# EAGLE board STXY (EAGLE 9.6.2)
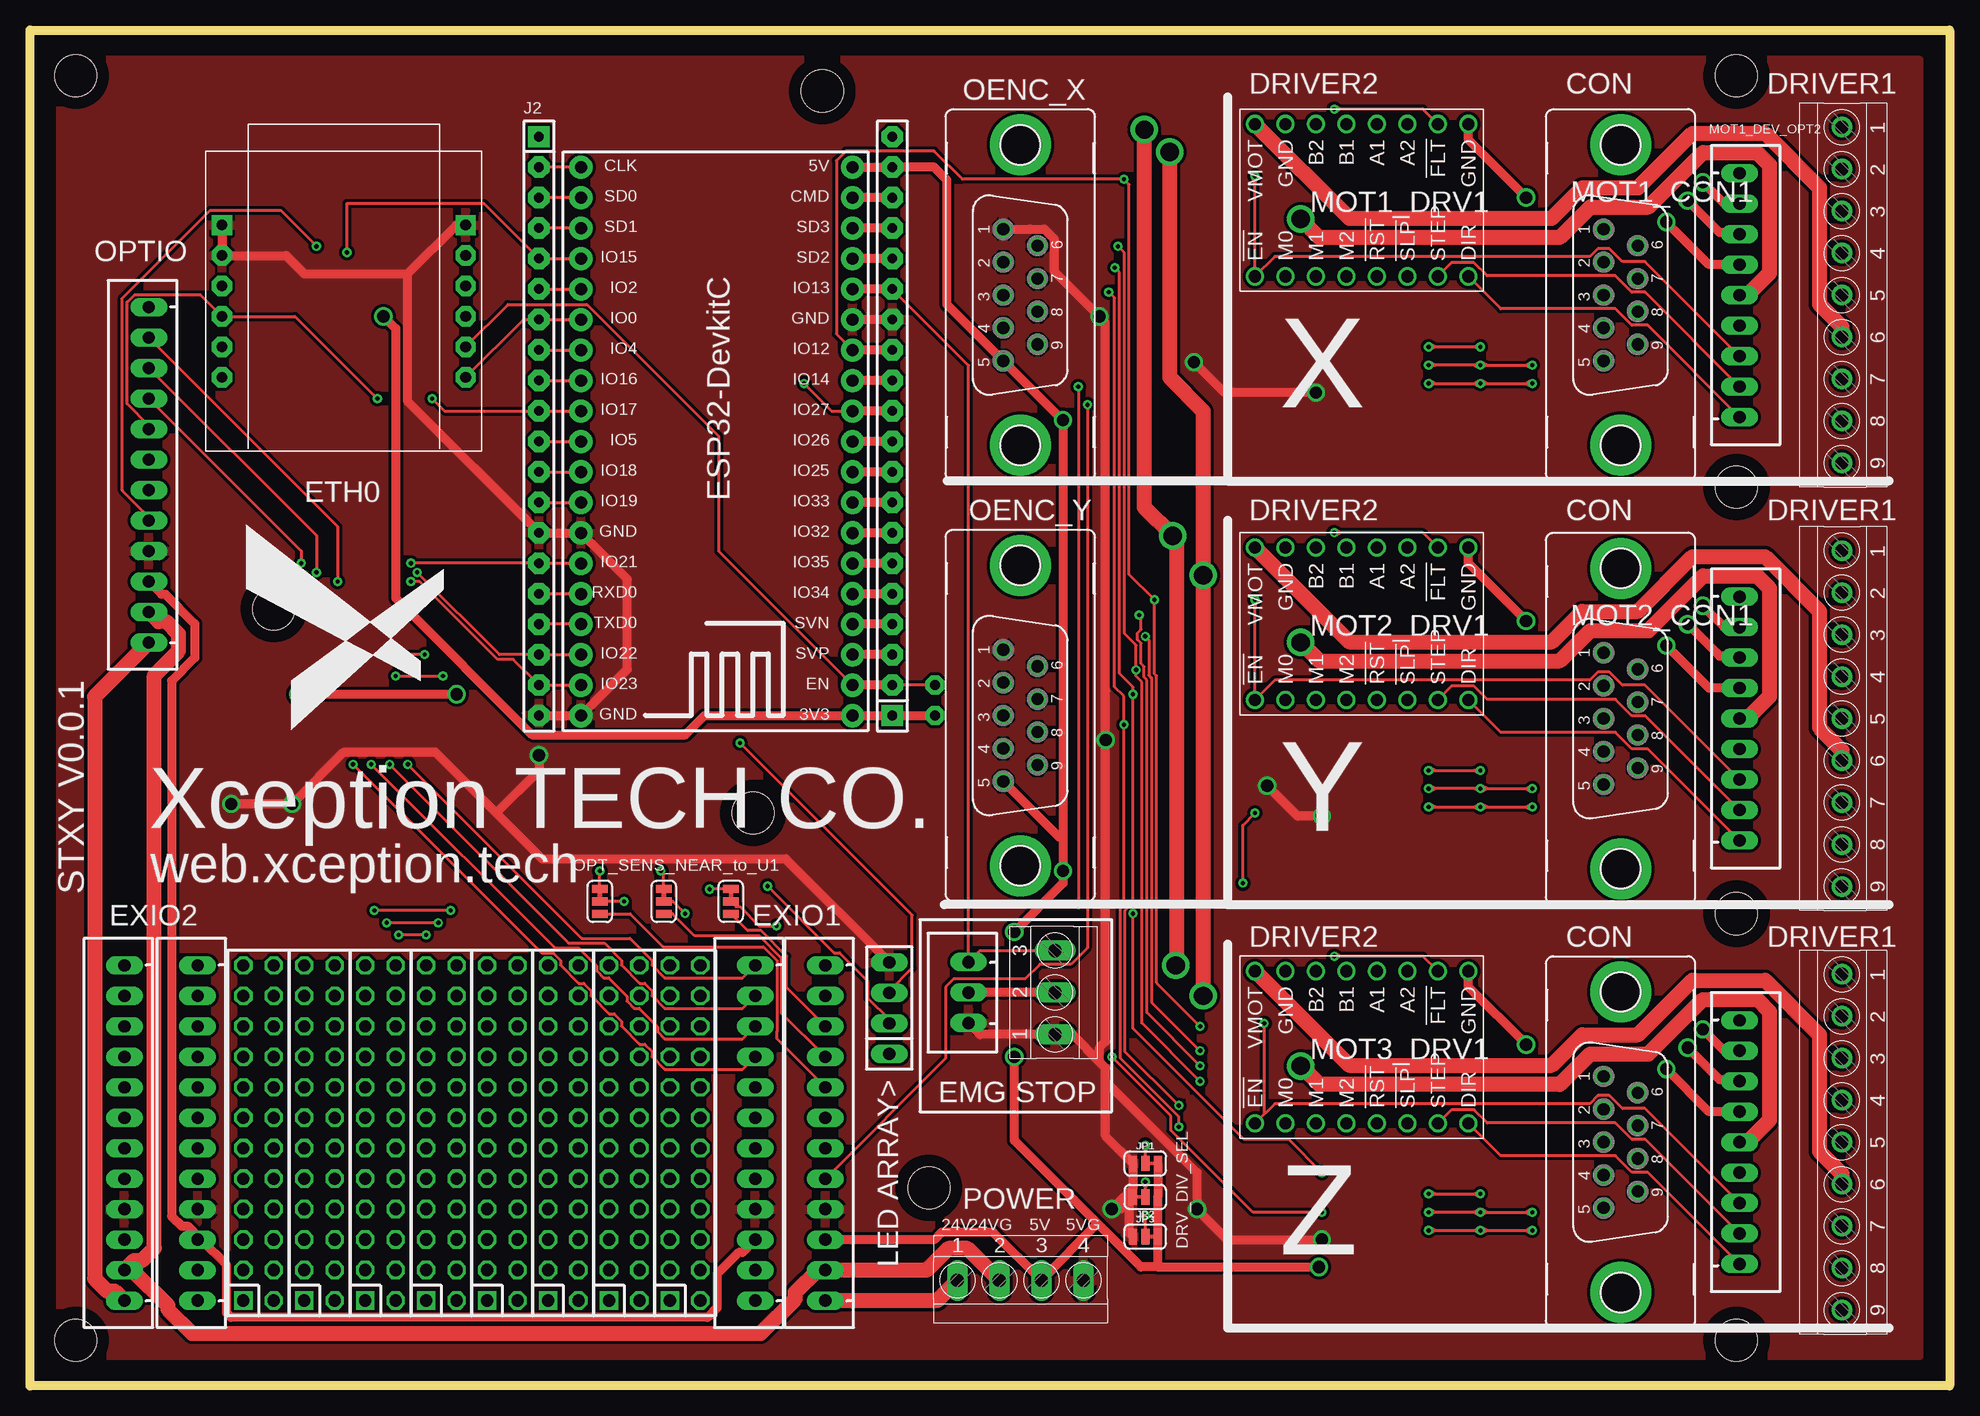
[diagram p4: board, top side]
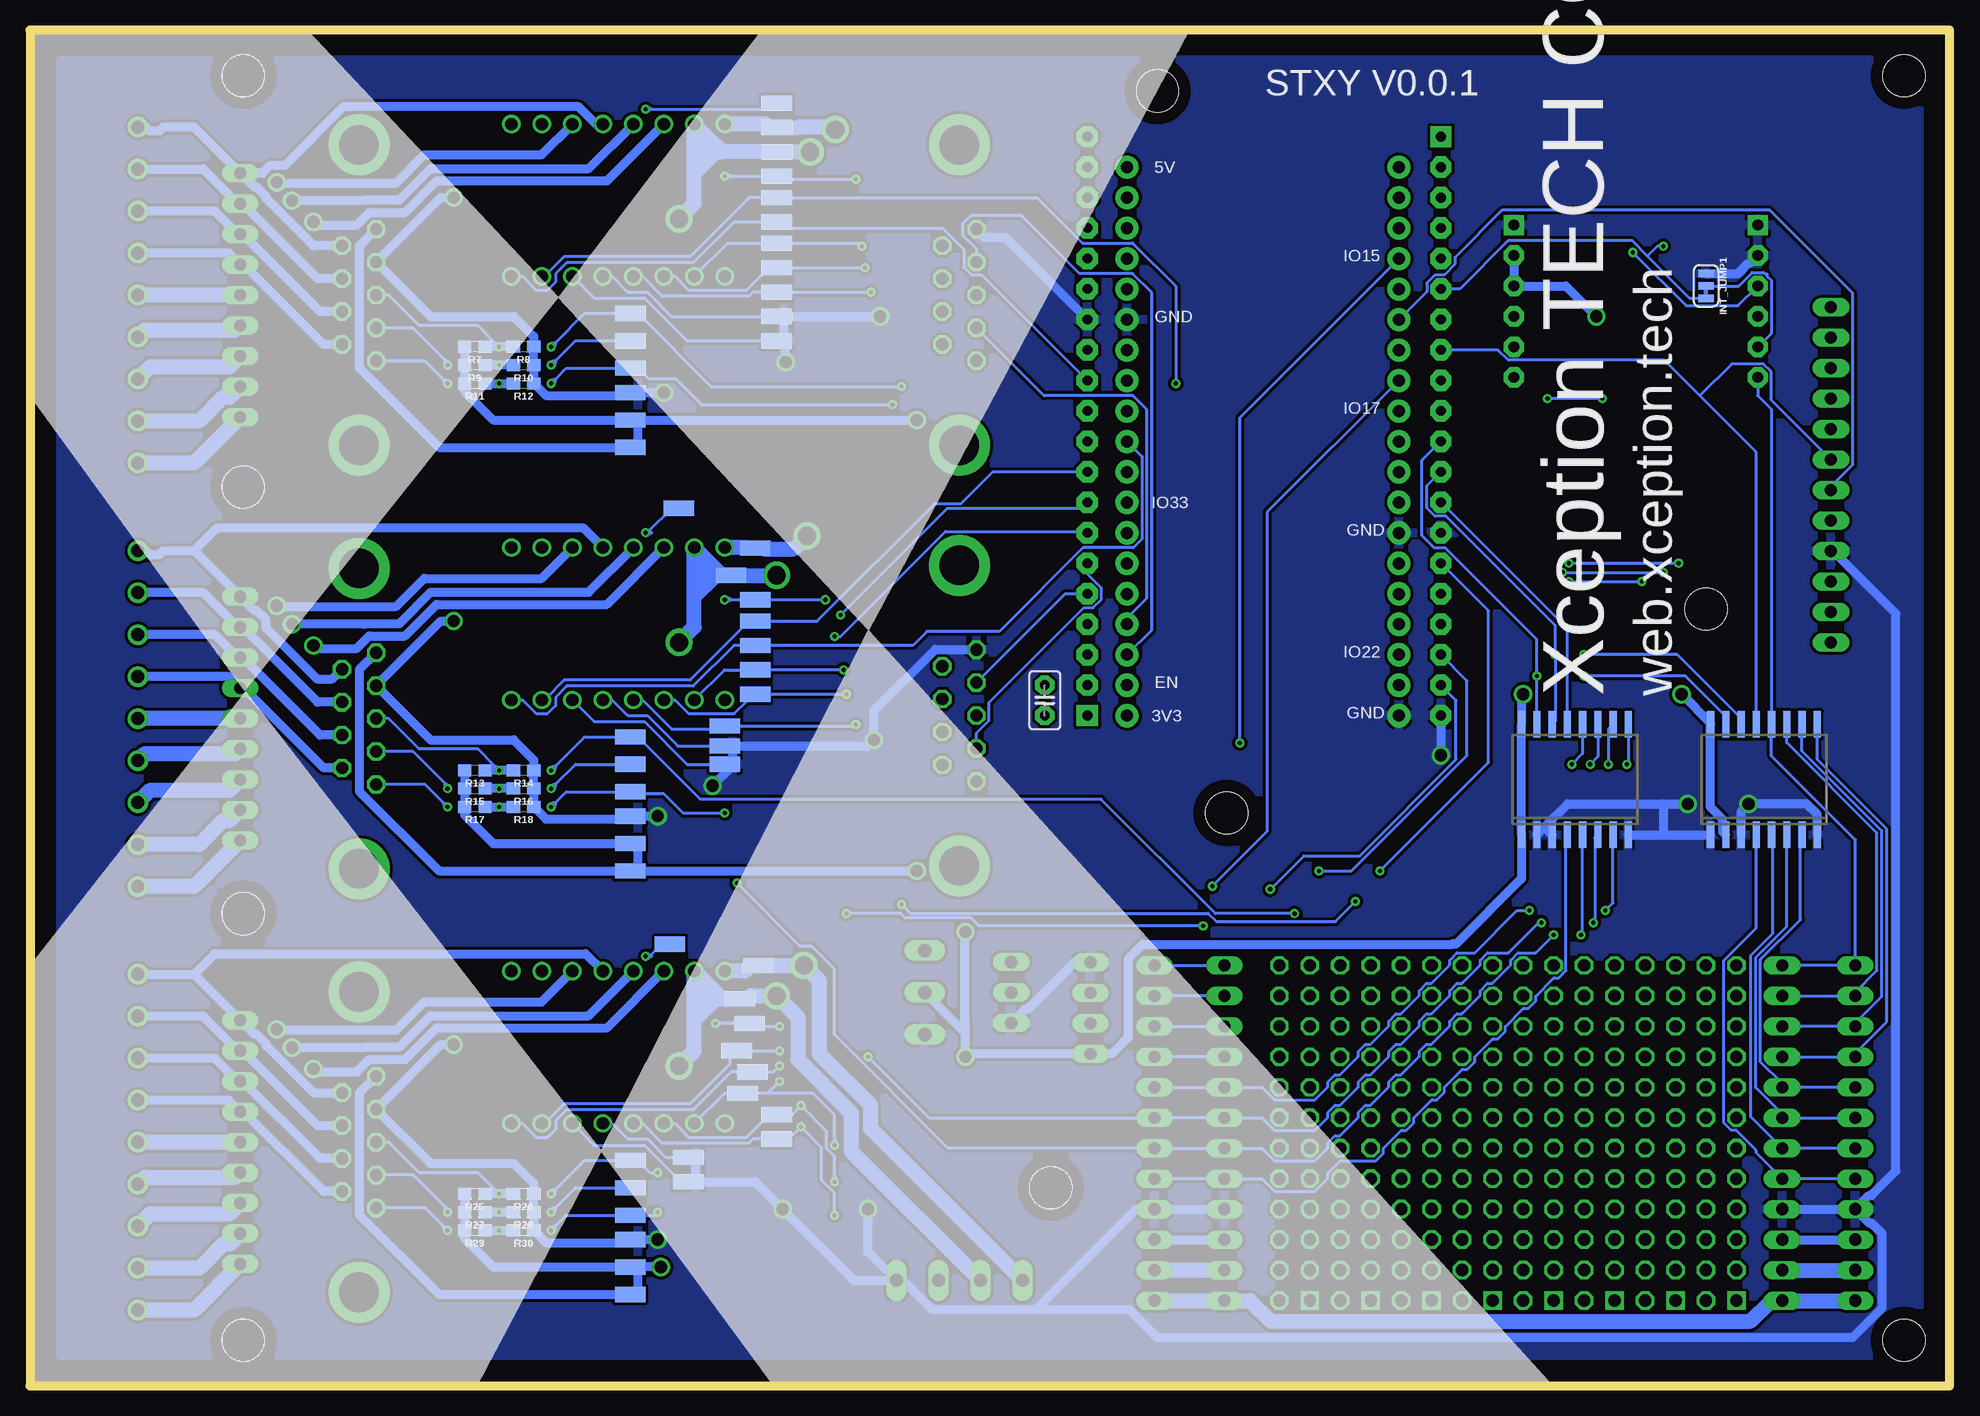
[diagram p5: board, bottom side, seen from below]

Size 160.02 x 113.03 mm. Coordinates in mm from the lower left corner, seen from the top.
Outline: 0,0 0,113.03 160.02,113.03 160.02,0 0,0
Copper layers (1*16): Top 0.035mm / dielectric 1.5mm / Bottom 0.035mm
Design rules "default": minimum track width 6mil, minimum drill 0.35mm, track to track 6mil, track to pad 6mil, pad to pad 6mil, via to via 6mil, smd to smd 6mil, copper to edge 40mil, drill to drill 6mil, minimum pad ring 10mil, minimum via ring 8mil, stop-mask expansion 4mil, vias tented up to drill 0mil, thermal gap 10mil
Net classes: 0 default: width 0.254 mm, clearance 0.127 mm; 1 H POWER: width 1.27 mm, drill 1.524 mm, clearance 0.33 mm; 2 M POWER: width 0.762 mm, drill 1.016 mm, clearance 0.254 mm; 3 S POWER: width 0.254 mm, clearance 0.254 mm
Holes 3.5 mm at 142.24,74.93 142.24,39.37 142.24,3.81 3.81,3.81 3.81,109.22 142.24,109.22 20.32,64.77 60.27,47.76 66.04,107.95 74.93,16.51

## Footprints (pad centres in the part's own frame; a part is rotated, then mirrored left to right if it is on the bottom)
C2.5-2 = drill 0.813 pad 1.6 octagon: 1 -1.27,0; 2 1.27,0
SMT-JUMPER_3_1-NC_TRACE_SILK = smd 0.66 x 1.27: 1 -1.041,0; 2 0,0; 3 1.041,0
WIZ820IO = drill 0.9 pad 1.676 square: J1.1 -10.16,6.35; J2.1 10.16,6.35 | drill 0.9 pad 1.676 octagon: J1.2 -10.16,3.81; J1.3 -10.16,1.27; J1.4 -10.16,-1.27; J1.5 -10.16,-3.81; J1.6 -10.16,-6.35; J2.2 10.16,3.81; J2.3 10.16,1.27; J2.4 10.16,-1.27; J2.5 10.16,-3.81; J2.6 10.16,-6.35
SO16W = smd 0.6 x 2.2: 1 -4.445,-4.6; 2 -3.175,-4.6; 3 -1.905,-4.6; 4 -0.635,-4.6; 5 0.635,-4.6; 6 1.905,-4.6; 7 3.175,-4.6; 8 4.445,-4.6; 9 4.445,4.6; 10 3.175,4.6; 11 1.905,4.6; 12 0.635,4.6; 13 -0.635,4.6; 14 -1.905,4.6; 15 -3.175,4.6; 16 -4.445,4.6
SIP-100-20-32 = drill 0.813 pad 1.778 square: 1 -24.13,0 | drill 0.813 pad 1.778 octagon: 2 -21.59,0; 3 -19.05,0; 4 -16.51,0; 5 -13.97,0; 6 -11.43,0; 7 -8.89,0; 8 -6.35,0; 9 -3.81,0; 10 -1.27,0; 11 1.27,0; 12 3.81,0; 13 6.35,0; 14 8.89,0; 15 11.43,0; 16 13.97,0; 17 16.51,0; 18 19.05,0; 19 21.59,0; 20 24.13,0
DIL-100-2X12_M = drill 1.016 square: 1 -13.97,1.27 | drill 1.016 octagon: 2 -13.97,-1.27; 3 -11.43,1.27; 4 -11.43,-1.27; 5 -8.89,1.27; 6 -8.89,-1.27; 7 -6.35,1.27; 8 -6.35,-1.27; 9 -3.81,1.27; 10 -3.81,-1.27; 11 -1.27,1.27; 12 -1.27,-1.27; 13 1.27,1.27; 14 1.27,-1.27; 15 3.81,1.27; 16 3.81,-1.27; 17 6.35,1.27; 18 6.35,-1.27; 19 8.89,1.27; 20 8.89,-1.27; 21 11.43,1.27; 22 11.43,-1.27; 23 13.97,1.27; 24 13.97,-1.27
SIP-100-04-40Y = drill 1.016 long: 1 -3.81,0; 2 -1.27,0; 3 1.27,0; 4 3.81,0
SHORT_TOP-50 = smd 1.27 x 1.27: 1 0.635,0; 2 -0.635,0
F09VP = drill 1.016 octagon: 1 5.486,1.422; 2 2.743,1.422; 3 0,1.422; 4 -2.743,1.422; 5 -5.486,1.422; 6 4.115,-1.422; 7 1.372,-1.422; 8 -1.372,-1.422; 9 -4.115,-1.422 | drill 3.302 pad 5.08: G1 -12.522,0; G2 12.522,0
DRV8825 = drill 1.016: 1 -6.35,8.89; 2 -6.35,6.35; 3 -6.35,3.81; 4 -6.35,1.27; 5 -6.35,-1.27; 6 -6.35,-3.81; 7 -6.35,-6.35; 8 -6.35,-8.89; 9 6.35,-8.89; 10 6.35,-6.35; 11 6.35,-3.81; 12 6.35,-1.27; 13 6.35,1.27; 14 6.35,3.81; 15 6.35,6.35; 16 6.35,8.89
TERMINAL-BLOCK-9-PIN-3.5MM-ROUND-PAD = drill 1.1 pad 1.7: 1 -13.973,-0.1; 2 -10.473,-0.1; 3 -6.973,-0.1; 4 -3.473,-0.1; 5 0.028,-0.1; 6 3.527,-0.1; 7 7.027,-0.1; 8 10.527,-0.1; 9 14.027,-0.1
JST-XH-09-PACKAGE-LONG-PAD = drill 1.016 long: 1 -10.16,0; 2 -7.62,0; 3 -5.08,0; 4 -2.54,0; 5 0,0; 6 2.54,0; 7 5.08,0; 8 7.62,0; 9 10.16,0
TERMINAL-BLOCK-4-PIN-3.5MM-LONG-PAD = drill 1.1 pad 1.7 long: 1 -5.25,-0.1; 2 -1.75,-0.1; 3 1.75,-0.1; 4 5.25,-0.1
0603 = smd 1.1 x 1: 1 -0.85,0; 2 0.85,0
ESP32-DEVKITC = drill 1 pad 1.93: 1 -22.87,-11.42; 2 -20.33,-11.42; 3 -17.79,-11.42; 4 -15.25,-11.42; 5 -12.71,-11.42; 6 -10.17,-11.42; 7 -7.63,-11.42; 8 -5.09,-11.42; 9 -2.55,-11.42; 10 -0.01,-11.42; 11 2.53,-11.42; 12 5.07,-11.42; 13 7.61,-11.42; 14 10.15,-11.42; 15 12.69,-11.42; 16 15.23,-11.42; 17 17.77,-11.42; 18 20.31,-11.42; 19 22.85,-11.42; 20 22.85,11.23; 21 20.31,11.23; 22 17.77,11.23; 23 15.23,11.23; 24 12.69,11.23; 25 10.15,11.23; 26 7.61,11.23; 27 5.07,11.23; 28 2.53,11.23; 29 -0.01,11.23; 30 -2.55,11.23; 31 -5.09,11.23; 32 -7.63,11.23; 33 -10.17,11.23; 34 -12.71,11.23; 35 -15.25,11.23; 36 -17.79,11.23; 37 -20.33,11.23; 38 -22.87,11.23
JST-XH-03-PACKAGE-LONG-PAD = drill 1.016 long: 1 -2.54,0; 2 0,0; 3 2.54,0
TERMINAL-BLOCK-3-PIN-3.5MM-LONG-PAD = drill 1.1 pad 1.7 long: 1 -3.5,-0.1; 2 0,-0.1; 3 3.5,-0.1
JST-XH-12-PACKAGE-LONG-PAD = drill 1.016 long: 1 -13.97,0; 2 -11.43,0; 3 -8.89,0; 4 -6.35,0; 5 -3.81,0; 6 -1.27,0; 7 1.27,0; 8 3.81,0; 9 6.35,0; 10 8.89,0; 11 11.43,0; 12 13.97,0

## Placement (x,y rotation side)
C2  [C2.5-2]  75.44,57.15 270 bottom
EIO1_A6  [SMT-JUMPER_3_1-NC_TRACE_SILK]  47.5,40.39 90 top
EIO1_A7  [SMT-JUMPER_3_1-NC_TRACE_SILK]  52.83,40.39 90 top
EIO1_A8  [SMT-JUMPER_3_1-NC_TRACE_SILK]  58.42,40.39 90 top
ETH0  [WIZ820IO]  26.16,90.42 0 top
EXIO1  PCF8574T  [SO16W]  31.24,50.55 0 bottom
EXIO2  PCF8574T  [SO16W]  15.49,50.55 0 bottom
INT_JUMP1  [SMT-JUMPER_3_1-NC_TRACE_SILK]  20.32,91.69 270 bottom
J1  F-1X20-SIP-100-32  [SIP-100-20-32]  71.88,80.01 90 top
J2  F-1X20-SIP-100-32  [SIP-100-20-32]  42.42,80.01 270 top
J8  F-2X12-DIL-100_M  [DIL-100-2X12_M]  39.37,21.08 90 top
J10  F-2X12-DIL-100_M  [DIL-100-2X12_M]  34.29,21.08 90 top
J11  F-2X12-DIL-100_M  [DIL-100-2X12_M]  19.05,21.08 90 top
J12  F-2X12-DIL-100_M  [DIL-100-2X12_M]  24.13,21.08 90 top
J13  F-2X12-DIL-100_M  [DIL-100-2X12_M]  29.21,21.08 90 top
J14  F-2X12-DIL-100_M  [DIL-100-2X12_M]  44.45,21.08 90 top
J15  F-2X12-DIL-100_M  [DIL-100-2X12_M]  49.53,21.08 90 top
J17  F-2X12-DIL-100_M  [DIL-100-2X12_M]  54.61,21.08 90 top
J_SK9822  F-1X04-SIP-100-40Y  [SIP-100-04-40Y]  71.63,31.5 90 top
JP1  [SMT-JUMPER_3_1-NC_TRACE_SILK]  92.96,18.54 0 top
JP2  [SMT-JUMPER_3_1-NC_TRACE_SILK]  92.96,15.75 180 top
JP3  [SMT-JUMPER_3_1-NC_TRACE_SILK]  92.96,12.45 0 top
MOT1_!EN1  SHORTT5  [SHORT_TOP-50]  97.79,100.84 0 bottom
MOT1_!FLT1  SHORTT5  [SHORT_TOP-50]  97.79,106.93 0 bottom
MOT1_!RST1  SHORTT5  [SHORT_TOP-50]  97.79,89.15 0 bottom
MOT1_!SLP1  SHORTT5  [SHORT_TOP-50]  97.79,87.12 0 bottom
MOT1_CON1  [F09VP]  132.59,90.93 90 top
MOT1_DRV1  2133-DRV8825  [DRV8825]  111,98.84 90 top
MOT1_DRV_OPT3  [TERMINAL-BLOCK-9-PIN-3.5MM-ROUND-PAD]  151.13,90.96 270 top
MOT1_DRV_OPT4  JST-XH-09-PIN-LONG-PAD  [JST-XH-09-PACKAGE-LONG-PAD]  142.49,90.93 270 top
MOT1_M3  SHORTT5  [SHORT_TOP-50]  97.79,95.25 0 bottom
MOT1_M4  SHORTT5  [SHORT_TOP-50]  97.79,93.22 0 bottom
MOT1_M5  SHORTT5  [SHORT_TOP-50]  97.79,91.19 0 bottom
MOT1_MCU_GND1  SHORTT5  [SHORT_TOP-50]  109.98,82.8 0 bottom
MOT1_MCU_VDD1  SHORTT5  [SHORT_TOP-50]  109.98,80.52 0 bottom
MOT1_MD_DIR1  SHORTT5  [SHORT_TOP-50]  97.79,97.03 0 bottom
MOT1_MD_STEP1  SHORTT5  [SHORT_TOP-50]  97.79,99.06 0 bottom
MOT1_MOT_GND1  SHORTT5  [SHORT_TOP-50]  97.79,102.87 0 bottom
MOT1_MOT_VMOT1  SHORTT5  [SHORT_TOP-50]  97.79,104.9 0 bottom
MOT1_SENSOR_SFAR1  SHORTT5  [SHORT_TOP-50]  109.98,84.84 0 bottom
MOT1_SENSOR_SMID1  SHORTT5  [SHORT_TOP-50]  109.98,87.12 0 bottom
MOT1_SENSOR_SNEAR1  SHORTT5  [SHORT_TOP-50]  109.98,89.41 0 bottom
MOT1_SENSOR_VDD1  SHORTT5  [SHORT_TOP-50]  109.98,78.23 0 bottom
MOT2_!EN1  SHORTT5  [SHORT_TOP-50]  99.57,65.53 0 bottom
MOT2_!FLT1  SHORTT5  [SHORT_TOP-50]  105.92,73.15 0 bottom
MOT2_!RST1  SHORTT5  [SHORT_TOP-50]  102.11,53.34 0 bottom
MOT2_!SLP1  SHORTT5  [SHORT_TOP-50]  102.11,51.82 0 bottom
MOT2_CON1  [F09VP]  132.59,55.63 90 top
MOT2_DRV1  2133-DRV8825  [DRV8825]  111,63.53 90 top
MOT2_DRV_OPT3  [TERMINAL-BLOCK-9-PIN-3.5MM-ROUND-PAD]  151.13,55.65 270 top
MOT2_DRV_OPT4  JST-XH-09-PIN-LONG-PAD  [JST-XH-09-PACKAGE-LONG-PAD]  142.49,55.63 270 top
MOT2_M3  SHORTT5  [SHORT_TOP-50]  99.57,59.69 0 bottom
MOT2_M4  SHORTT5  [SHORT_TOP-50]  99.57,57.66 0 bottom
MOT2_M5  SHORTT5  [SHORT_TOP-50]  102.1,55.01 0 bottom
MOT2_MCU_GND1  SHORTT5  [SHORT_TOP-50]  109.98,47.5 0 bottom
MOT2_MCU_VDD1  SHORTT5  [SHORT_TOP-50]  109.98,45.21 0 bottom
MOT2_MD_DIR1  SHORTT5  [SHORT_TOP-50]  99.57,61.72 0 bottom
MOT2_MD_STEP1  SHORTT5  [SHORT_TOP-50]  99.57,63.75 0 bottom
MOT2_MOT_GND1  SHORTT5  [SHORT_TOP-50]  101.6,67.56 0 bottom
MOT2_MOT_VMOT1  SHORTT5  [SHORT_TOP-50]  99.57,69.85 0 bottom
MOT2_SENSOR_SFAR1  SHORTT5  [SHORT_TOP-50]  109.98,49.53 0 bottom
MOT2_SENSOR_SMID1  SHORTT5  [SHORT_TOP-50]  109.98,51.82 0 bottom
MOT2_SENSOR_SNEAR1  SHORTT5  [SHORT_TOP-50]  109.98,54.1 0 bottom
MOT2_SENSOR_VDD1  SHORTT5  [SHORT_TOP-50]  109.98,42.93 0 bottom
MOT3_!EN1  SHORTT5  [SHORT_TOP-50]  100.08,30.23 0 bottom
MOT3_!FLT1  SHORTT5  [SHORT_TOP-50]  106.68,36.83 0 bottom
MOT3_!RST1  SHORTT5  [SHORT_TOP-50]  105.16,19.05 0 bottom
MOT3_!SLP1  SHORTT5  [SHORT_TOP-50]  105.16,17.02 0 bottom
MOT3_CON1  [F09VP]  132.59,20.32 90 top
MOT3_DRV1  2133-DRV8825  [DRV8825]  111,28.23 90 top
MOT3_DRV_OPT3  [TERMINAL-BLOCK-9-PIN-3.5MM-ROUND-PAD]  151.13,20.35 270 top
MOT3_DRV_OPT4  JST-XH-09-PIN-LONG-PAD  [JST-XH-09-PACKAGE-LONG-PAD]  142.49,20.32 270 top
MOT3_M3  SHORTT5  [SHORT_TOP-50]  100.58,24.38 0 bottom
MOT3_M4  SHORTT5  [SHORT_TOP-50]  97.79,22.61 0 bottom
MOT3_M5  SHORTT5  [SHORT_TOP-50]  97.79,20.57 0 bottom
MOT3_MCU_GND1  SHORTT5  [SHORT_TOP-50]  109.98,12.19 0 bottom
MOT3_MCU_VDD1  SHORTT5  [SHORT_TOP-50]  109.98,9.91 0 bottom
MOT3_MD_DIR1  SHORTT5  [SHORT_TOP-50]  99.82,26.16 0 bottom
MOT3_MD_STEP1  SHORTT5  [SHORT_TOP-50]  101.09,27.94 0 bottom
MOT3_MOT_GND1  SHORTT5  [SHORT_TOP-50]  100.84,32.26 0 bottom
MOT3_MOT_VMOT1  SHORTT5  [SHORT_TOP-50]  99.31,35.05 0 bottom
MOT3_SENSOR_SFAR1  SHORTT5  [SHORT_TOP-50]  109.98,14.22 0 bottom
MOT3_SENSOR_SMID1  SHORTT5  [SHORT_TOP-50]  109.98,16.51 0 bottom
MOT3_SENSOR_SNEAR1  SHORTT5  [SHORT_TOP-50]  109.98,18.8 0 bottom
MOT3_SENSOR_VDD1  SHORTT5  [SHORT_TOP-50]  109.98,7.62 0 bottom
OPTICAL_ENC_X:OENC  [F09VP]  82.55,90.93 90 top
OPTICAL_ENC_Y:OENC  [F09VP]  82.55,55.88 90 top
POW_EUROSTYLE  [TERMINAL-BLOCK-4-PIN-3.5MM-LONG-PAD]  82.55,8.89 0 top
R7  [0603]  122.94,86.61 180 bottom
R8  [0603]  118.87,86.61 180 bottom
R9  [0603]  122.94,85.09 180 bottom
R10  [0603]  118.87,85.09 180 bottom
R11  [0603]  122.94,83.57 180 bottom
R12  [0603]  118.87,83.57 180 bottom
R13  [0603]  122.94,51.31 180 bottom
R14  [0603]  118.87,51.31 180 bottom
R15  [0603]  122.94,49.78 180 bottom
R16  [0603]  118.87,49.78 180 bottom
R17  [0603]  122.94,48.26 180 bottom
R18  [0603]  118.87,48.26 180 bottom
R25  [0603]  122.94,16 180 bottom
R26  [0603]  118.87,16 180 bottom
R27  [0603]  122.94,14.48 180 bottom
R28  [0603]  118.87,14.48 180 bottom
R29  [0603]  122.94,12.95 180 bottom
R30  [0603]  118.87,12.95 180 bottom
U1  ESP32DEVKITC  [ESP32-DEVKITC]  57.15,78.74 90 top
X1  EMG_BTN  [JST-XH-03-PACKAGE-LONG-PAD]  78.23,32.78 90 top
X2  [TERMINAL-BLOCK-3-PIN-3.5MM-LONG-PAD]  85.34,32.78 90 top
X3  JST-XH-12-PIN-LONG-PAD  [JST-XH-12-PACKAGE-LONG-PAD]  7.87,21.08 90 top
X4  JST-XH-12-PIN-LONG-PAD  [JST-XH-12-PACKAGE-LONG-PAD]  13.97,21.08 90 top
X5  JST-XH-12-PIN-LONG-PAD  [JST-XH-12-PACKAGE-LONG-PAD]  60.45,21.08 90 top
X6  JST-XH-12-PIN-LONG-PAD  [JST-XH-12-PACKAGE-LONG-PAD]  66.29,21.08 90 top
X7  JST-XH-12-PIN-LONG-PAD  [JST-XH-12-PACKAGE-LONG-PAD]  9.91,75.95 90 top

## Tracks (layer width: path | path; a pad name or v marks a point on that pad's centre or on a via)
EMG_SIG
  Top 0.254: X2.3 79.19,36.28 X1.3 78.23,85.07 J1.15
  Top 0.762: J1.15 U1.15
ETH0_INT
  Bottom 0.254: X4.12 X3.12 7.87,45.53 14.86,52.51 EXIO2.12 14.86,81.41 16,82.55 ETH0.J1.6
EXIO1_INT
  Top 0.254: J2.13 U1.31
  Bottom 0.254: EXIO1.13 31.88,63.12 J2.13
EXT_5V  (via drill 1.02)
  Top 0.762: 93.98,9.91 v107.44,9.91 | 93.98,9.91 94,9.93 JP3.3 JP2.1 JP1.3 | 93.98,9.91 92.6,9.91 88.97,13.53 | X2.2 X1.2 | v82.04,27.43 82.04,20.46 88.97,13.53 | 88.97,13.53 84.3,8.86 POW_EUROSTYLE.3 80.29,12.8 75.99,12.8 75.38,12.19 X6.3 | 14.28,12.19 16.38,10.08 16.38,6.09 16.75,5.71 56.46,5.71 57.28,6.53 57.28,9.32 59.08,11.12 59.38,11.12 X5.3 | 14.28,12.19 X4.3 | 86.11,45.72 v86.11,80.52 86.06,80.52 OPTICAL_ENC_X:OENC.5 76.42,90.15 76.42,100.52 75.34,101.6 J1.19 U1.19 | 86.11,45.72 v86.11,42.93 86.11,41.91 v82.04,37.85 | OPTICAL_ENC_Y:OENC.5 85.8,45.72 86.11,45.72 | v22.35,57.66 v35.56,57.66 | X7.3 10.97,65.99 11.28,65.99 13.74,63.53 13.74,60.7 11.81,58.77 11.81,14.15 12.63,13.34 13.13,13.34 14.28,12.19
  Bottom 0.762: MOT1_SENSOR_VDD1.1 MOT1_MCU_VDD1.1 v86.11,80.52 | v86.11,42.93 MOT2_SENSOR_VDD1.1 MOT2_MCU_VDD1.1 | v107.44,9.91 MOT3_MCU_VDD1.1 MOT3_SENSOR_VDD1.1 | X2.2 82.08,29.42 82.08,30.23 | 82.08,30.23 82.08,37.8 v82.04,37.85 | X6.3 X5.3 | X4.3 X3.3 | EXIO2.2 18.92,46.2 18.92,47.23 19.94,48.24 EXIO2.16 19.94,55.24 v22.35,57.66 | v35.56,57.66 35.69,57.53 EXIO1.16 EXIO1.1 35.69,42.29 41.12,36.85 41.39,36.85 41.44,36.8 67.28,36.8 68.45,35.63 68.45,29.08 69.85,27.69 J_SK9822.1 81.79,27.69 v82.04,27.43 82.04,30.18 82.08,30.23
EXT_24V  (via drill 1.52)
  Top 1.27: POW_EUROSTYLE.1 75.62,7.11 X6.1 | v95.5,35.05 95.58,35.12 95.58,70.28 95.25,70.61 v95.25,70.87 92.89,73.23 v92.89,104.72 | X3.1 7.06,7.92 6.4,7.92 5.38,8.94 5.38,57.45 X7.1
  Bottom 1.27: MOT3_MOT_VMOT1.1 v95.5,35.05 94.23,33.78 94.23,27.68 89.97,23.42 89.97,21.46 POW_EUROSTYLE.1 | v95.25,70.87 96.34,69.77 98.86,69.77 MOT2_MOT_VMOT1.1 | X3.1 X4.1 14.89,7.11 16.62,5.38 56.59,5.38 58.32,7.11 X5.1 X6.1 | MOT1_MOT_VMOT1.1 95.94,104.9 95.87,104.98 93.14,104.98 v92.89,104.72
EXT_24V_GND  (via drill 1.52)
  Top 1.27: v95,102.87 95,84.07 97.79,81.28 v97.79,67.56 v97.79,32.51 | POW_EUROSTYLE.2 78.14,11.46 76.55,11.46 74.75,9.65 X6.2 65.63,9.65 63.8,7.83 63.8,7.26 60.91,4.37 13.51,4.37 11.48,6.4 11.48,6.71 8.54,9.65 X3.2 8.69,10.46 9.35,10.46 10.36,11.48 10.36,59.23 12.39,61.26 12.39,62.69 11.38,63.7 10.72,63.7 X7.2
  Bottom 1.27: MOT3_MOT_GND1.1 99.95,32.51 v97.79,32.51 96.01,30.73 96.01,27.2 91.57,22.75 91.57,19.56 POW_EUROSTYLE.2 | MOT2_MOT_GND1.1 v97.79,67.56 | X5.2 X6.2 | X4.2 X3.2 | MOT1_MOT_GND1.1 v95,102.87
EXT_GND  (via drill 1.02)
  Top 0.762: J2.20 U1.38 49.78,59.73 49.78,67.25 U1.32 J2.14 31.5,82.04 31.5,92.71 | v107.19,82.8 99.57,82.8 v97.03,85.34 | v107.7,47.5 105.66,47.5 v103.12,50.04 | v107.7,12.19 99.82,12.19 v97.28,14.73 97.28,17.78 89.66,25.4 | 89.66,25.4 89.66,20.8 JP1.1 91.92,16.45 91.62,16.14 91.62,15.75 | X1.1 79.19,29.28 X2.1 86.89,29.28 89.16,27.01 | J1.14 U1.14 | 89.66,25.4 89.66,26.51 89.16,27.01 | 89.16,27.01 89.16,28.2 89.66,28.7 v89.66,53.85 89.66,57.94 89.64,57.96 89.64,88.67 v89.15,89.15 85.37,92.94 85.37,95.62 84.55,96.44 83.39,96.44 83.37,96.42 OPTICAL_ENC_X:OENC.1 | ETH0.J1.1 ETH0.J1.2 21.34,94.23 22.86,92.71 31.5,92.71 | 31.5,92.71 35.56,96.77 ETH0.J2.1 | v16.76,48.51 v21.84,48.51 26.16,52.83 33.78,52.83 38.86,47.75 | v42.42,52.58 42.42,51.31 38.86,47.75 | 38.86,47.75 42.67,43.94 62.99,43.94 J_SK9822.4 | JP3.1 91.62,12.75 91.62,15.75 | 91.62,15.75 91.19,15.75 v90.17,14.73 90.91,14.73 JP2.3
  Bottom 0.762: MOT1_MCU_GND1.1 v107.19,82.8 | v97.03,85.34 97.03,87 MOT1_!SLP1.1 MOT1_!RST1.1 v89.15,89.15 | MOT2_MCU_GND1.1 v107.7,47.5 | v103.12,50.04 101.47,51.69 MOT2_!SLP1.1 MOT2_!RST1.1 90.17,53.34 v89.66,53.85 89.66,56.28 84.55,61.39 81.15,61.39 OPTICAL_ENC_Y:OENC.1 | MOT3_!RST1.1 MOT3_!SLP1.1 99.57,17.02 v97.28,14.73 91.34,8.79 POW_EUROSTYLE.4 | v107.7,12.19 MOT3_MCU_GND1.1 | POW_EUROSTYLE.4 87.25,8.79 84.84,6.38 76.17,6.38 | 76.17,6.38 67.82,14.73 X6.4 X5.4 | 76.17,6.38 68.41,6.38 66.07,4.04 8.1,4.04 5.64,6.5 5.64,12.69 6.53,13.59 6.73,13.59 X3.4 | X4.4 X3.4 | EXIO1.8 23.88,45.95 | 23.88,45.95 EXIO2.1 | 23.88,48.51 23.88,45.95 | EXIO1.3 33.78,46.58 | EXIO1.2 33.78,46.58 | EXIO2.8 11.05,47.62 11.94,48.51 v16.76,48.51 17.4,47.88 EXIO2.3 | 33.78,46.58 31.85,48.51 23.88,48.51 | 23.88,48.51 v21.84,48.51 | X1.1 77.09,31.39 76.89,31.39 72.97,35.31 J_SK9822.4 | POW_EUROSTYLE.4 90.17,11.16 v90.17,14.73 | J2.20 v42.42,52.58 | INT_JUMP1.1 17.62,92.73 16.78,93.57 16.66,93.57 ETH0.J1.2 | OPTICAL_ENC_X:OENC.1 80.47,95.76 78.74,95.76 J1.14 | X3.4 6.73,15.88 6.53,15.88 4.5,17.91 4.5,64.38 9.71,69.6 X7.4
  pour Bottom: 2.54,5.08 2.54,110.49 157.48,110.49 157.48,3.81 157.48,2.54 2.54,2.54
  pour Top: 2.54,110.49 2.54,2.54 157.48,2.54 157.48,5.08 157.48,110.49
LED_ARR_CLK  (via drill 0.35)
  Top 0.254: J2.9 U1.27 | v61.47,41.66 67.03,36.09 67.49,36.09 69.83,33.76 69.83,32.34 71.63,30.53 J_SK9822.2
  Bottom 0.254: v61.47,41.66 56.9,46.23 56.9,72.83 U1.27
MOT1_!EN  (via drill 0.35)
  Top 0.254: MOT1_DRV_OPT4.7 134.62,93.73 132.73,93.73 131.64,94.82 130.69,94.82 130.01,94.14 103.76,94.14 MOT1_DRV1.1 102.11,100.31 | 102.11,100.31 v102.11,100.84 | 102.11,100.31 102.33,100.72 v102.11,100.84 | 102.11,100.31 101.89,100.72 v102.11,100.84
  Bottom 0.254: v102.11,100.84 101.58,100.84 | 101.58,100.84 MOT1_!EN1.2 | 101.58,100.84 101.99,100.62 v102.11,100.84 | 101.58,100.84 101.99,101.06 v102.11,100.84
  Bottom 1.27: MOT1_DRV_OPT4.7 143.38,84.96 150,84.96 MOT1_DRV_OPT3.7
MOT1_!FLT  (via drill 0.35)
  Top 0.254: MOT1_DRV1.10 116.11,106.43 109.24,106.43 | 109.24,106.43 v108.71,106.43 | 109.24,106.43 108.83,106.65 v108.71,106.43 | 109.24,106.43 108.83,106.2 v108.71,106.43
  Bottom 0.254: v108.71,106.43 108.19,106.43 | 108.19,106.43 98.93,106.43 MOT1_!FLT1.2 | 108.19,106.43 108.59,106.2 v108.71,106.43 | 108.19,106.43 108.59,106.65 v108.71,106.43
MOT1_!RST
  Bottom 0.254: MOT1_DRV1.5 111.51,92.49 110.2,91.19 108.55,91.19 106.52,89.15 MOT1_!RST1.2
MOT1_!SLP
  Bottom 0.254: MOT1_DRV1.6 113,90.68 108.81,90.68 105.25,87.12 MOT1_!SLP1.2
MOT1_M0
  Bottom 0.254: MOT1_DRV1.2 101.89,95.25 MOT1_M3.2
MOT1_M1
  Bottom 0.254: MOT1_DRV1.3 106.26,92.49 105.12,91.35 100.3,91.35 MOT1_M4.2
MOT1_M2
  Bottom 0.254: MOT1_M5.2 99.74,91.19 100.09,90.84 107.31,90.84 108.97,92.49 MOT1_DRV1.4
MOT1_MCU_GND  (via drill 1.02)
  Top 0.762: v124.71,99.06 119.89,103.89 MOT1_DRV1.9
  Bottom 0.762: v124.71,99.06 125.78,99.06 MOT1_CON1.2 126.64,89.15 119.7,89.15 118.02,87.48 R8.1 R10.1 R12.1 117.01,82.55 110.87,82.55 MOT1_MCU_GND1.2
MOT1_MCU_VDD
  Bottom 0.762: R7.2 R9.2 R11.2 123.79,82.89 121.41,80.52 MOT1_MCU_VDD1.2
MOT1_MD_DIR
  Top 0.254: MOT1_DRV_OPT4.9 134.85,88.42 133.54,88.42 132.16,89.79 122.59,89.79 MOT1_DRV1.8
  Bottom 0.254: MOT1_DRV1.8 118.96,92.49 117.82,91.35 116.88,91.35 116.2,92.02 116.2,92.71 115.28,93.63 104.74,93.63 101.35,97.03 MOT1_MD_DIR1.2
  Bottom 1.27: MOT1_DRV_OPT4.9 146.33,76.93 MOT1_DRV_OPT3.9
MOT1_MD_STEP
  Top 0.254: MOT1_DRV_OPT4.8 134.65,91.16 133.54,91.16 132.16,92.53 121.46,92.53 120.36,93.63 118.49,93.63 MOT1_DRV1.7
  Bottom 0.254: MOT1_MD_STEP1.2 100.08,99.06 105,94.14 115.49,94.14 117.14,92.49 MOT1_DRV1.7
  Bottom 1.27: MOT1_DRV_OPT4.8 143.38,82.42 143.94,82.42 145.93,80.43 MOT1_DRV_OPT3.8
MOT1_MOT_GND  (via drill 1.52)
  Top 1.27: MOT1_DRV_OPT4.5 143.16,90.93 144.98,92.76 144.98,101.81 143.97,102.82 139.45,102.82 134.9,98.27 130.05,98.27 127.51,95.73 107.47,95.73 v105.92,97.28
  Bottom 1.27: MOT1_DRV_OPT4.5 MOT1_DRV_OPT3.5 | 102.33,102.87 103.36,103.9 | 103.36,103.9 MOT1_DRV1.15 104.65,102.87 | v105.92,97.28 104.65,98.55 104.65,101.09 | 104.65,101.09 104.65,102.87 | 104.65,101.09 102.87,102.87 102.33,102.87 | 104.65,102.87 104.39,102.87 103.36,103.9 | MOT1_MOT_GND1.2 102.33,102.87
MOT1_MOT_VMOT
  Top 1.27: MOT1_DRV_OPT3.6 151.03,88.29 149.16,90.16 149.16,99.89 144.63,104.42 138.58,104.42 134.03,99.87 129.38,99.87 126.85,97.33 109.96,97.33 MOT1_DRV1.16
  Bottom 1.27: MOT1_DRV_OPT4.6 142.88,88.01 150.45,88.01 MOT1_DRV_OPT3.6 | MOT1_MOT_VMOT1.2 98.71,105.19 MOT1_DRV1.16
MOT1_SENSOR_SFAR  (via drill 0.35)
  Top 0.254: v116.59,83.57 117.11,83.57 | 117.11,83.57 120.38,83.57 | 120.38,83.57 v120.9,83.57 | v120.9,83.57 | v120.9,83.57 | v120.9,83.57 121.43,83.57 | 121.43,83.57 124.7,83.57 | 124.7,83.57 v125.22,83.57 | 117.11,83.57 116.71,83.79 v116.59,83.57 | 117.11,83.57 116.71,83.34 v116.59,83.57 | 120.38,83.57 120.78,83.34 v120.9,83.57 | 120.38,83.57 120.78,83.79 v120.9,83.57 | 121.43,83.57 121.02,83.79 v120.9,83.57 | 121.43,83.57 121.02,83.34 v120.9,83.57 | 124.7,83.57 125.1,83.34 v125.22,83.57 | 124.7,83.57 125.1,83.79 v125.22,83.57
  Bottom 0.254: v125.22,83.57 125.59,83.94 | 125.59,83.94 127.1,85.45 MOT1_CON1.5 | v116.59,83.57 116.22,83.94 | 116.22,83.94 115.32,84.84 MOT1_SENSOR_SFAR1.2 | 116.22,83.94 116.34,83.5 v116.59,83.57 | 116.22,83.94 116.66,83.81 v116.59,83.57 | 125.59,83.94 125.15,83.81 v125.22,83.57 | 125.59,83.94 125.46,83.5 v125.22,83.57 | v120.9,83.57
  Bottom 0.762: R12.2 v120.9,83.57 R11.1
MOT1_SENSOR_SMID  (via drill 0.35)
  Top 0.254: v120.9,85.09 120.38,85.09 | 120.38,85.09 117.11,85.09 | 117.11,85.09 v116.59,85.09 | v120.9,85.09 121.43,85.09 | 121.43,85.09 124.7,85.09 | 124.7,85.09 v125.22,85.09 | 117.11,85.09 116.71,85.31 v116.59,85.09 | 117.11,85.09 116.71,84.87 v116.59,85.09 | 124.7,85.09 125.1,84.87 v125.22,85.09 | 124.7,85.09 125.1,85.31 v125.22,85.09 | 120.38,85.09 120.78,84.87 v120.9,85.09 | 120.38,85.09 120.78,85.31 v120.9,85.09 | 121.43,85.09 121.02,85.31 v120.9,85.09 | 121.43,85.09 121.02,84.87 v120.9,85.09
  Bottom 0.254: v125.22,85.09 125.22,85.33 125.46,85.56 | 125.46,85.56 128.09,88.19 MOT1_CON1.4 | v116.59,85.09 116.22,85.46 | 116.22,85.46 114.55,87.12 MOT1_SENSOR_SMID1.2 | 116.22,85.46 116.34,85.02 v116.59,85.09 | 116.22,85.46 116.66,85.33 v116.59,85.09 | 125.46,85.56 125.08,85.3 v125.22,85.09 | 125.46,85.56 125.47,85.1 v125.22,85.09
  Bottom 0.762: R10.2 v120.9,85.09 R9.1
MOT1_SENSOR_SNEAR  (via drill 0.35)
  Top 0.254: v116.59,86.61 117.11,86.61 | 117.11,86.61 120.38,86.61 | 120.38,86.61 v120.9,86.61 | 117.11,86.61 116.71,86.83 v116.59,86.61 | 117.11,86.61 116.71,86.39 v116.59,86.61 | 120.38,86.61 120.78,86.39 v120.9,86.61 | 120.38,86.61 120.78,86.83 v120.9,86.61
  Bottom 0.254: v120.9,86.61 121.28,86.98 | 121.28,86.98 122.68,88.39 127.57,88.39 130.11,90.93 MOT1_CON1.3 | v116.59,86.61 116.22,86.98 | 116.22,86.98 113.79,89.41 MOT1_SENSOR_SNEAR1.2 | 116.22,86.98 116.34,86.54 v116.59,86.61 | 116.22,86.98 116.66,86.86 v116.59,86.61 | 121.28,86.98 120.83,86.86 v120.9,86.61 | 121.28,86.98 121.14,86.54 v120.9,86.61
  Bottom 0.762: R7.1 v120.9,86.61 R8.2
MOT1_SENSOR_VDD
  Bottom 0.762: MOT1_CON1.1 132.56,95.02 132.56,84.87 125.93,78.23 MOT1_SENSOR_VDD1.2
MOT1_SOCK_A+
  Bottom 0.762: MOT1_DRV_OPT4.1 146.33,104.93 148.9,104.93 149.21,104.62 150.06,104.62 150.37,104.93 MOT1_DRV_OPT3.1 | MOT1_DRV_OPT4.1 141.35,99.95 141.15,99.95 140.34,99.13 140.34,98.99 136.39,95.05 MOT1_CON1.6 | MOT1_DRV1.12 112.83,105.19 114.27,106.63 133.91,106.63 138.81,101.73 140.03,101.73 140.66,101.09 MOT1_DRV_OPT4.1
MOT1_SOCK_A-  (via drill 1.02)
  Top 0.762: MOT1_DRV_OPT4.2 141.22,98.55 v139.45,100.33
  Bottom 0.762: MOT1_DRV1.11 117.38,102.62 127.16,102.62 129.5,100.28 139.4,100.28 v139.45,100.33 | MOT1_DRV_OPT3.2 145.57,101.43 142.69,98.55 MOT1_DRV_OPT4.2 142.3,98.55 136.05,92.3 MOT1_CON1.7
MOT1_SOCK_B+  (via drill 1.02)
  Top 0.762: v138.18,98.81 140.84,96.14 142.37,96.14 MOT1_DRV_OPT4.3
  Bottom 0.762: MOT1_DRV_OPT3.3 144.61,97.93 142.69,96.01 MOT1_DRV_OPT4.3 142.3,96.01 135.84,89.56 MOT1_CON1.8 | v138.18,98.81 132.19,98.81 132.16,98.83 129.26,98.83 126.62,101.47 113.44,101.47 MOT1_DRV1.13
MOT1_SOCK_B-  (via drill 1.02)
  Top 0.762: MOT1_DRV_OPT4.4 139.95,93.47 v136.4,97.03
  Bottom 0.762: MOT1_DRV_OPT3.4 143.45,94.43 MOT1_DRV_OPT4.4 142.19,93.47 135.53,86.82 MOT1_CON1.9 | v136.4,97.03 136.4,96.78 136.4,96.77 132.79,96.77 131.74,97.81 128.75,97.81 126.11,100.46 111.92,100.46 MOT1_DRV1.14
MOT2_!EN  (via drill 0.35)
  Top 0.254: MOT2_DRV_OPT4.7 134.62,58.42 132.73,58.42 131.64,59.51 130.69,59.51 130.01,58.83 103.76,58.83 MOT2_DRV1.1 102.11,65.01 | 102.11,65.01 v102.11,65.53 | 102.11,65.01 102.33,65.41 v102.11,65.53 | 102.11,65.01 101.89,65.41 v102.11,65.53
  Bottom 0.254: v102.11,65.53 101.58,65.53 | 101.58,65.53 MOT2_!EN1.2 | 101.58,65.53 101.99,65.31 v102.11,65.53 | 101.58,65.53 101.99,65.75 v102.11,65.53
  Bottom 1.27: MOT2_DRV_OPT4.7 143.38,49.66 150,49.66 MOT2_DRV_OPT3.7
MOT2_!FLT  (via drill 0.35)
  Top 0.254: MOT2_DRV1.10 116.11,71.12 109.24,71.12 | 109.24,71.12 v108.71,71.12 | 109.24,71.12 108.83,71.34 v108.71,71.12 | 109.24,71.12 108.83,70.9 v108.71,71.12
  Bottom 0.254: v108.71,71.12 108.19,71.12 | 108.44,71.26 MOT2_!FLT1.2 | 108.19,71.12 108.59,70.9 v108.71,71.12 | 108.19,71.12 108.44,71.26 | 108.44,71.26 108.59,71.34 v108.71,71.12
MOT2_!RST
  Bottom 0.254: MOT2_DRV1.5 111.51,57.18 110.2,55.88 108.55,55.88 106.01,53.34 MOT2_!RST1.2
MOT2_!SLP
  Bottom 0.254: MOT2_DRV1.6 113,55.37 108.81,55.37 105.25,51.82 MOT2_!SLP1.2
MOT2_M0
  Bottom 0.254: MOT2_DRV1.2 102.14,59.69 MOT2_M3.2
MOT2_M1
  Bottom 0.254: MOT2_DRV1.3 106.26,57.18 105.12,56.04 101.31,56.04 100.2,57.15 MOT2_M4.2
MOT2_M2
  Bottom 0.254: MOT2_M5.2 102.97,54.77 106.55,54.77 108.97,57.18 MOT2_DRV1.4
MOT2_MCU_GND  (via drill 1.02)
  Top 0.762: v124.71,63.75 119.89,68.58 MOT2_DRV1.9
  Bottom 0.762: v124.71,63.75 125.78,63.75 MOT2_CON1.2 126.64,53.85 119.7,53.85 118.02,52.17 R14.1 R16.1 R18.1 117.01,47.25 110.87,47.25 MOT2_MCU_GND1.2
MOT2_MCU_VDD
  Bottom 0.762: R13.2 R15.2 R17.2 123.79,47.59 121.41,45.21 MOT2_MCU_VDD1.2
MOT2_MD_DIR
  Top 0.254: MOT2_DRV_OPT4.9 134.85,53.11 133.54,53.11 132.16,54.48 122.59,54.48 MOT2_DRV1.8
  Bottom 0.254: MOT2_DRV1.8 118.96,57.18 117.82,56.04 116.88,56.04 116.2,56.71 116.2,57.4 115.28,58.33 104.74,58.33 101.35,61.72 MOT2_MD_DIR1.2
  Bottom 1.27: MOT2_DRV_OPT4.9 146.33,41.63 MOT2_DRV_OPT3.9
MOT2_MD_STEP
  Top 0.254: MOT2_DRV_OPT4.8 134.65,55.85 133.54,55.85 132.16,57.23 121.46,57.23 120.36,58.33 118.49,58.33 MOT2_DRV1.7
  Bottom 0.254: MOT2_MD_STEP1.2 100.2,63.63 105,58.83 115.49,58.83 117.14,57.18 MOT2_DRV1.7
  Bottom 1.27: MOT2_DRV_OPT4.8 143.38,47.12 143.94,47.12 145.93,45.13 MOT2_DRV_OPT3.8
MOT2_MOT_GND  (via drill 1.52)
  Top 1.27: MOT2_DRV_OPT4.5 143.16,55.63 144.98,57.45 144.98,66.5 143.97,67.51 139.45,67.51 134.9,62.97 130.05,62.97 127.51,60.43 107.47,60.43 v105.92,61.98
  Bottom 1.27: MOT2_DRV_OPT4.5 MOT2_DRV_OPT3.5 | 102.33,67.56 103.36,68.6 | 103.36,68.6 MOT2_DRV1.15 104.65,67.56 | v105.92,61.98 104.65,63.25 104.65,65.79 | 104.65,65.79 104.65,67.56 | MOT2_MOT_GND1.2 102.33,67.56 | 104.65,65.79 102.87,67.56 102.33,67.56 | 104.65,67.56 104.39,67.56 103.36,68.6
MOT2_MOT_VMOT
  Top 1.27: MOT2_DRV_OPT3.6 151.03,52.99 149.16,54.85 149.16,64.58 144.63,69.11 138.58,69.11 134.03,64.57 129.38,64.57 126.85,62.03 109.96,62.03 MOT2_DRV1.16
  Bottom 1.27: MOT2_DRV_OPT4.6 142.88,52.7 150.45,52.7 MOT2_DRV_OPT3.6 | MOT2_MOT_VMOT1.2 100.24,69.88 MOT2_DRV1.16
MOT2_SENSOR_SFAR  (via drill 0.35)
  Top 0.254: v116.59,48.26 117.11,48.26 | 117.11,48.26 120.38,48.26 | 120.38,48.26 v120.9,48.26 | v120.9,48.26 | v120.9,48.26 | v120.9,48.26 121.43,48.26 | 121.43,48.26 124.7,48.26 | 124.7,48.26 v125.22,48.26 | 117.11,48.26 116.71,48.48 v116.59,48.26 | 117.11,48.26 116.71,48.04 v116.59,48.26 | 120.38,48.26 120.78,48.04 v120.9,48.26 | 120.38,48.26 120.78,48.48 v120.9,48.26 | 121.43,48.26 121.02,48.48 v120.9,48.26 | 121.43,48.26 121.02,48.04 v120.9,48.26 | 124.7,48.26 125.1,48.04 v125.22,48.26 | 124.7,48.26 125.1,48.48 v125.22,48.26
  Bottom 0.254: v125.22,48.26 125.59,48.63 | 125.59,48.63 127.1,50.14 MOT2_CON1.5 | v116.59,48.26 116.22,48.63 | 116.22,48.63 115.32,49.53 MOT2_SENSOR_SFAR1.2 | 116.22,48.63 116.34,48.19 v116.59,48.26 | 116.22,48.63 116.66,48.5 v116.59,48.26 | 125.59,48.63 125.15,48.5 v125.22,48.26 | 125.59,48.63 125.46,48.19 v125.22,48.26 | v120.9,48.26
  Bottom 0.762: R18.2 v120.9,48.26 R17.1
MOT2_SENSOR_SMID  (via drill 0.35)
  Top 0.254: v120.9,49.78 120.38,49.78 | 120.38,49.78 117.11,49.78 | 117.11,49.78 v116.59,49.78 | v120.9,49.78 121.43,49.78 | 121.43,49.78 124.7,49.78 | 124.7,49.78 v125.22,49.78 | 117.11,49.78 116.71,50.01 v116.59,49.78 | 117.11,49.78 116.71,49.56 v116.59,49.78 | 124.7,49.78 125.1,49.56 v125.22,49.78 | 124.7,49.78 125.1,50.01 v125.22,49.78 | 120.38,49.78 120.78,49.56 v120.9,49.78 | 120.38,49.78 120.78,50.01 v120.9,49.78 | 121.43,49.78 121.02,50.01 v120.9,49.78 | 121.43,49.78 121.02,49.56 v120.9,49.78
  Bottom 0.254: v125.22,49.78 125.22,50.02 125.46,50.25 | 125.46,50.25 128.09,52.88 MOT2_CON1.4 | v116.59,49.78 116.22,50.16 | 116.22,50.16 114.55,51.82 MOT2_SENSOR_SMID1.2 | 116.22,50.16 116.34,49.71 v116.59,49.78 | 116.22,50.16 116.66,50.02 v116.59,49.78 | 125.46,50.25 125.08,49.99 v125.22,49.78 | 125.46,50.25 125.47,49.79 v125.22,49.78
  Bottom 0.762: R16.2 v120.9,49.78 R15.1
MOT2_SENSOR_SNEAR  (via drill 0.35)
  Top 0.254: v116.59,51.31 117.11,51.31 | 117.11,51.31 120.38,51.31 | 120.38,51.31 v120.9,51.31 | 117.11,51.31 116.71,51.53 v116.59,51.31 | 117.11,51.31 116.71,51.09 v116.59,51.31 | 120.38,51.31 120.78,51.09 v120.9,51.31 | 120.38,51.31 120.78,51.53 v120.9,51.31
  Bottom 0.254: v120.9,51.31 121.28,51.68 | 121.28,51.68 122.68,53.09 127.57,53.09 130.11,55.63 MOT2_CON1.3 | v116.59,51.31 116.22,51.68 | 116.22,51.68 113.79,54.1 MOT2_SENSOR_SNEAR1.2 | 116.22,51.68 116.34,51.24 v116.59,51.31 | 116.22,51.68 116.66,51.55 v116.59,51.31 | 121.28,51.68 120.83,51.55 v120.9,51.31 | 121.28,51.68 121.14,51.24 v120.9,51.31
  Bottom 0.762: R13.1 v120.9,51.31 R14.2
MOT2_SENSOR_VDD
  Bottom 0.762: MOT2_CON1.1 132.56,59.72 132.56,49.56 125.93,42.93 MOT2_SENSOR_VDD1.2
MOT2_SOCK_A+
  Bottom 0.762: 146.33,69.63 MOT2_DRV_OPT4.1 141.35,64.64 141.15,64.64 140.34,63.83 140.34,63.17 136.09,58.93 134.82,58.93 MOT2_CON1.6 | 146.33,69.63 144.43,71.53 113.92,71.53 MOT2_DRV1.12 | MOT2_DRV_OPT3.1 150.37,69.63 150.06,69.31 149.21,69.31 148.9,69.63 146.33,69.63
MOT2_SOCK_A-  (via drill 1.02)
  Top 0.762: MOT2_DRV_OPT4.2 141.22,63.25 v139.45,65.02
  Bottom 0.762: MOT2_DRV1.11 117.38,67.31 127.16,67.31 129.5,64.97 139.4,64.97 v139.45,65.02 | MOT2_DRV_OPT3.2 145.57,66.13 142.69,63.25 MOT2_DRV_OPT4.2 142.3,63.25 136.05,57 MOT2_CON1.7
MOT2_SOCK_B+  (via drill 1.02)
  Top 0.762: v138.18,63.5 140.84,60.83 142.37,60.83 MOT2_DRV_OPT4.3
  Bottom 0.762: MOT2_DRV_OPT3.3 144.61,62.63 142.69,60.71 MOT2_DRV_OPT4.3 142.3,60.71 135.84,54.25 MOT2_CON1.8 | v138.18,63.5 132.19,63.5 132.16,63.52 129.26,63.52 126.62,66.17 113.44,66.17 MOT2_DRV1.13
MOT2_SOCK_B-  (via drill 1.02)
  Top 0.762: MOT2_DRV_OPT4.4 139.95,58.17 v136.4,61.72
  Bottom 0.762: MOT2_DRV_OPT3.4 143.45,59.13 MOT2_DRV_OPT4.4 142.19,58.17 135.53,51.51 MOT2_CON1.9 | v136.4,61.72 136.4,61.47 132.79,61.47 131.74,62.51 128.75,62.51 126.11,65.15 111.92,65.15 MOT2_DRV1.14
MOT3_!EN  (via drill 0.35)
  Top 0.254: MOT3_DRV_OPT4.7 134.62,23.11 132.73,23.11 131.64,24.21 130.69,24.21 130.01,23.53 103.76,23.53 MOT3_DRV1.1 102.87,22.64 102.87,30.21 | 102.87,30.21 v102.87,30.23 v102.86,30.22 102.87,30.21
  Bottom 0.254: MOT3_!EN1.2 v102.87,30.23
  Bottom 1.27: MOT3_DRV_OPT4.7 143.38,14.35 150,14.35 MOT3_DRV_OPT3.7
MOT3_!FLT  (via drill 0.35)
  Top 0.254: MOT3_DRV1.10 116.11,35.81 109.24,35.81 | 109.24,35.81 v108.71,35.81 | 109.24,35.81 108.83,36.03 v108.71,35.81 | 109.24,35.81 108.83,35.59 v108.71,35.81
  Bottom 0.254: v108.71,35.81 108.19,35.81 | 108.28,35.87 MOT3_!FLT1.2 | 108.19,35.81 108.59,35.59 v108.71,35.81 | 108.19,35.81 108.28,35.87 | 108.28,35.87 108.59,36.03 v108.71,35.81
MOT3_!RST
  Bottom 0.254: MOT3_DRV1.5 111.51,21.88 110.2,20.57 108.55,20.57 107.03,19.05 MOT3_!RST1.2
MOT3_!SLP
  Bottom 0.254: MOT3_DRV1.6 113,20.07 108.81,20.07 105.79,17.05 MOT3_!SLP1.2
MOT3_M0
  Bottom 0.254: MOT3_DRV1.2 102.14,24.38 MOT3_M3.2
MOT3_M1
  Bottom 0.254: MOT3_DRV1.3 106.26,21.88 105.12,20.73 100.3,20.73 MOT3_M4.2
MOT3_M2
  Bottom 0.254: MOT3_M5.2 99.74,20.57 100.09,20.23 107.31,20.23 108.97,21.88 MOT3_DRV1.4
MOT3_MCU_GND  (via drill 1.02)
  Top 0.762: v124.71,28.45 119.89,33.27 MOT3_DRV1.9
  Bottom 0.762: v124.71,28.45 125.78,28.45 MOT3_CON1.2 126.64,18.54 119.7,18.54 118.02,16.87 R26.1 R28.1 R30.1 117.01,11.94 110.87,11.94 MOT3_MCU_GND1.2
MOT3_MCU_VDD
  Bottom 0.762: R25.2 R27.2 R29.2 123.79,12.28 121.41,9.91 MOT3_MCU_VDD1.2
MOT3_MD_DIR
  Top 0.254: MOT3_DRV_OPT4.9 134.85,17.8 133.54,17.8 132.16,19.18 122.59,19.18 MOT3_DRV1.8
  Bottom 0.254: MOT3_DRV1.8 118.96,21.88 117.82,20.73 116.88,20.73 116.2,21.4 116.2,22.1 115.28,23.02 104.74,23.02 101.6,26.16 MOT3_MD_DIR1.2
  Bottom 1.27: MOT3_DRV_OPT4.9 146.33,6.32 MOT3_DRV_OPT3.9
MOT3_MD_STEP
  Top 0.254: MOT3_DRV_OPT4.8 134.65,20.55 133.54,20.55 132.16,21.92 121.46,21.92 120.36,23.02 118.49,23.02 MOT3_DRV1.7
  Bottom 0.254: MOT3_MD_STEP1.2 101.73,26.8 105,23.53 115.49,23.53 117.14,21.88 MOT3_DRV1.7
  Bottom 1.27: MOT3_DRV_OPT4.8 143.38,11.81 143.94,11.81 145.93,9.82 MOT3_DRV_OPT3.8
MOT3_MOT_GND  (via drill 1.52)
  Top 1.27: MOT3_DRV_OPT4.5 143.16,20.32 144.98,22.14 144.98,31.2 143.97,32.21 139.45,32.21 134.9,27.66 130.05,27.66 127.51,25.12 107.47,25.12 v105.92,26.67
  Bottom 1.27: MOT3_DRV_OPT4.5 MOT3_DRV_OPT3.5 | 102.33,32.26 103.36,33.29 | 103.36,33.29 MOT3_DRV1.15 104.65,32.26 | v105.92,26.67 104.65,27.94 104.65,30.48 | 104.65,30.48 104.65,32.26 | MOT3_MOT_GND1.2 102.33,32.26 | 104.65,30.48 102.87,32.26 102.33,32.26 | 104.65,32.26 104.39,32.26 103.36,33.29
MOT3_MOT_VMOT
  Top 1.27: MOT3_DRV_OPT3.6 151.03,17.68 149.16,19.55 149.16,29.28 144.63,33.81 138.58,33.81 134.03,29.26 129.38,29.26 126.85,26.72 109.96,26.72 MOT3_DRV1.16
  Bottom 1.27: MOT3_DRV_OPT4.6 142.88,17.4 150.45,17.4 MOT3_DRV_OPT3.6 | MOT3_MOT_VMOT1.2 100.42,34.58 MOT3_DRV1.16
MOT3_SENSOR_SFAR  (via drill 0.35)
  Top 0.254: v116.59,12.95 117.11,12.95 | 117.11,12.95 120.38,12.95 | 120.38,12.95 v120.9,12.95 | v120.9,12.95 | v120.9,12.95 | v120.9,12.95 121.43,12.95 | 121.43,12.95 124.7,12.95 | 124.7,12.95 v125.22,12.95 | 117.11,12.95 116.71,13.18 v116.59,12.95 | 117.11,12.95 116.71,12.73 v116.59,12.95 | 120.38,12.95 120.78,12.73 v120.9,12.95 | 120.38,12.95 120.78,13.18 v120.9,12.95 | 121.43,12.95 121.02,13.18 v120.9,12.95 | 121.43,12.95 121.02,12.73 v120.9,12.95 | 124.7,12.95 125.1,12.73 v125.22,12.95 | 124.7,12.95 125.1,13.18 v125.22,12.95
  Bottom 0.254: v125.22,12.95 125.59,13.32 | 125.59,13.32 127.1,14.83 MOT3_CON1.5 | v116.59,12.95 116.22,13.32 | 116.22,13.32 115.32,14.22 MOT3_SENSOR_SFAR1.2 | 116.22,13.32 116.34,12.88 v116.59,12.95 | 116.22,13.32 116.66,13.2 v116.59,12.95 | 125.59,13.32 125.15,13.2 v125.22,12.95 | 125.59,13.32 125.46,12.88 v125.22,12.95 | v120.9,12.95
  Bottom 0.762: R30.2 v120.9,12.95 R29.1
MOT3_SENSOR_SMID  (via drill 0.35)
  Top 0.254: v120.9,14.48 120.38,14.48 | 120.38,14.48 117.11,14.48 | 117.11,14.48 v116.59,14.48 | v120.9,14.48 121.43,14.48 | 121.43,14.48 124.7,14.48 | 124.7,14.48 v125.22,14.48 | 117.11,14.48 116.71,14.7 v116.59,14.48 | 117.11,14.48 116.71,14.26 v116.59,14.48 | 124.7,14.48 125.1,14.26 v125.22,14.48 | 124.7,14.48 125.1,14.7 v125.22,14.48 | 120.38,14.48 120.78,14.26 v120.9,14.48 | 120.38,14.48 120.78,14.7 v120.9,14.48 | 121.43,14.48 121.02,14.7 v120.9,14.48 | 121.43,14.48 121.02,14.26 v120.9,14.48
  Bottom 0.254: v125.22,14.48 125.22,14.71 125.46,14.95 | 125.46,14.95 128.09,17.58 MOT3_CON1.4 | v116.59,14.48 116.22,14.85 | 116.22,14.85 114.55,16.51 MOT3_SENSOR_SMID1.2 | 116.22,14.85 116.34,14.41 v116.59,14.48 | 116.22,14.85 116.66,14.72 v116.59,14.48 | 125.46,14.95 125.08,14.68 v125.22,14.48 | 125.46,14.95 125.47,14.49 v125.22,14.48
  Bottom 0.762: R28.2 v120.9,14.48 R27.1
MOT3_SENSOR_SNEAR  (via drill 0.35)
  Top 0.254: v116.59,16 117.11,16 | 117.11,16 120.38,16 | 120.38,16 v120.9,16 | 117.11,16 116.71,16.22 v116.59,16 | 117.11,16 116.71,15.78 v116.59,16 | 120.38,16 120.78,15.78 v120.9,16 | 120.38,16 120.78,16.22 v120.9,16
  Bottom 0.254: v120.9,16 121.28,16.37 | 121.28,16.37 122.68,17.78 127.57,17.78 130.11,20.32 MOT3_CON1.3 | v116.59,16 116.22,16.37 | 116.22,16.37 113.79,18.8 MOT3_SENSOR_SNEAR1.2 | 116.22,16.37 116.34,15.93 v116.59,16 | 116.22,16.37 116.66,16.24 v116.59,16 | 121.28,16.37 120.83,16.24 v120.9,16 | 121.28,16.37 121.14,15.93 v120.9,16
  Bottom 0.762: R25.1 v120.9,16 R26.2
MOT3_SENSOR_VDD
  Bottom 0.762: MOT3_CON1.1 132.56,24.41 132.56,14.26 125.93,7.62 MOT3_SENSOR_VDD1.2
MOT3_SOCK_A+
  Bottom 0.762: 146.33,34.32 MOT3_DRV_OPT4.1 141.35,29.34 141.15,29.34 140.34,28.52 140.34,28.38 136.39,24.43 MOT3_CON1.6 | MOT3_DRV_OPT3.1 146.33,34.32 | 146.33,34.32 144.64,36.02 113.71,36.02 MOT3_DRV1.12
MOT3_SOCK_A-  (via drill 1.02)
  Top 0.762: MOT3_DRV_OPT4.2 141.22,27.94 v139.45,29.72
  Bottom 0.762: MOT3_DRV1.11 117.38,32 127.16,32 129.5,29.67 139.4,29.67 v139.45,29.72 | MOT3_DRV_OPT3.2 145.57,30.82 142.69,27.94 MOT3_DRV_OPT4.2 142.3,27.94 136.05,21.69 MOT3_CON1.7
MOT3_SOCK_B+  (via drill 1.02)
  Top 0.762: v138.18,28.19 140.84,25.53 142.37,25.53 MOT3_DRV_OPT4.3
  Bottom 0.762: MOT3_DRV_OPT3.3 144.61,27.32 142.69,25.4 MOT3_DRV_OPT4.3 142.3,25.4 135.84,18.95 MOT3_CON1.8 | v138.18,28.19 132.19,28.19 132.16,28.22 129.26,28.22 126.62,30.86 113.44,30.86 MOT3_DRV1.13
MOT3_SOCK_B-  (via drill 1.02)
  Top 0.762: MOT3_DRV_OPT4.4 139.95,22.86 v136.4,26.42
  Bottom 0.762: MOT3_DRV_OPT3.4 143.45,23.82 MOT3_DRV_OPT4.4 142.19,22.86 135.53,16.2 MOT3_CON1.9 | v136.4,26.42 136.4,26.16 132.79,26.16 131.74,27.2 128.75,27.2 126.11,29.84 111.92,29.84 MOT3_DRV1.14
MOT_EN  (via drill 0.35)
  Top 0.254: v97.54,29.97 93.9,33.6 93.9,59.18 93.73,59.36 v93.73,65.53 91.62,67.64 91.62,100.15 v91.19,100.58 77.72,100.58 75.37,102.94 68.01,102.94 67.22,102.15 67.22,87.7 U1.13
  Top 0.762: J1.13 U1.13
  Bottom 0.254: MOT1_!EN1.1 96.9,100.58 v91.19,100.58 | v97.54,29.97 99.19,29.97 MOT3_!EN1.1 | MOT2_!EN1.1 v93.73,65.53
MOTX_DIR
  Top 0.762: J1.12 U1.12
  Bottom 0.254: MOT1_MD_DIR1.1 96.65,96.52 83.97,96.52 82.17,94.72 82.17,93.24 81.56,92.63 80.7,92.63 J1.12
MOTX_SENSOR_FAR  (via drill 0.35)
  Top 0.254: X6.5 76.33,27.3 76.33,33.26 77,33.93 82.95,33.93 84.18,35.15 86.76,35.15 88.14,36.53 v88.14,81.79
  Bottom 0.254: X6.5 X5.5 57.35,17.27 56.31,16.23 52.91,16.23 51.84,17.3 51.84,17.7 50.77,18.77 47.83,18.77 47.22,19.38 47.22,19.79 45.69,21.31 45.29,21.31 44.68,21.92 44.68,22.33 43.15,23.85 42.75,23.85 42.14,24.46 42.14,24.87 40.61,26.39 40.21,26.39 39.6,27 39.6,27.41 38.07,28.93 37.67,28.93 37.06,29.54 37.06,29.95 35.53,31.47 35.13,31.47 34.52,32.08 34.52,32.49 32.99,34.01 32.59,34.01 31.98,34.62 31.98,45.84 EXIO1.4 | MOT1_SENSOR_SFAR1.1 108.46,83.95 106.21,83.95 104.05,81.79 v88.14,81.79
MOTX_SENSOR_NEAR  (via drill 0.35)
  Top 0.254: v49.53,40.39 EIO1_A6.2 | v87.38,83.31 v87.38,40.13
  Bottom 0.254: v87.38,83.31 103.25,83.31 MOT1_SENSOR_SNEAR1.1 | v87.38,40.13 86.64,39.4 61.81,39.4 61.13,38.71 51.2,38.71 v49.53,40.39
MOTX_STEP  (via drill 0.35)
  Top 0.254: v64.52,83.57 66.81,81.27 U1.11
  Top 0.762: J1.11 U1.11
  Bottom 0.254: MOT1_MD_STEP1.1 76.07,99.06 72.28,95.27 68.11,95.27 64.52,91.68 v64.52,83.57
MOTXY_M0  (via drill 0.35)
  Top 0.254: JP1.2 92.96,19.54 | 92.96,19.54 v92.96,20.07 | 92.96,19.54 93.19,19.95 v92.96,20.07 | 92.96,19.54 92.74,19.95 v92.96,20.07 | v97.54,25.4 92.69,30.25 92.69,58.67 92.2,59.16 v92.2,59.69 92.2,61.74 91.21,62.73 91.21,94.46 v90.68,95
  Bottom 0.254: v92.96,20.07 92.96,20.59 | 92.96,20.59 92.96,22.61 94.74,24.38 MOT3_M3.1 98.55,24.38 v97.54,25.4 | 92.96,20.59 92.74,20.19 v92.96,20.07 | 92.96,20.59 93.19,20.19 v92.96,20.07 | v92.2,59.69 MOT2_M3.1 | MOT1_M3.1 90.93,95.25 v90.68,95
MOTXY_M1  (via drill 0.35)
  Top 0.254: JP2.2 92.96,16.49 | 92.96,16.49 v92.96,17.02 | 92.96,16.49 93.19,16.9 v92.96,17.02 | 92.96,16.49 92.74,16.9 v92.96,17.02 | v90.42,93.22 90.81,92.84 90.81,59.4 91.95,58.25 v91.95,57.66 91.95,40.3 91.29,39.64 91.29,27.84 v95.76,23.37
  Bottom 0.254: MOT2_M4.1 v91.95,57.66 | v92.96,17.02 92.96,17.54 | 92.96,17.54 92.96,19.14 93.62,19.79 93.62,21.23 v95.76,23.37 96.52,22.61 MOT3_M4.1 | 92.96,17.54 92.74,17.14 v92.96,17.02 | 92.96,17.54 93.19,17.14 v92.96,17.02 | MOT1_M4.1 v90.42,93.22
MOTXY_M2  (via drill 0.35)
  Top 0.254: v95.76,21.59 95.76,22.44 90.88,27.31 90.88,39.81 91.19,40.11 v91.19,55.12 91.19,57.49 90.4,58.28 90.4,90.7 v89.92,91.19 | JP3.2 v92.96,14.22
  Bottom 0.254: MOT1_M5.1 v89.92,91.19 | MOT3_M5.1 96.77,20.57 v95.76,21.59 94.03,19.86 94.03,17.15 92.96,16.09 v92.96,14.22 | MOT2_M5.1 91.3,55.01 v91.19,55.12
MOTY_DIR
  Top 0.762: J1.10 U1.10
  Bottom 0.254: MOT2_MD_DIR1.1 86.42,61.72 85.25,62.89 79.22,62.89 72.25,69.86 68.05,69.86 67.33,70.59 67.33,77.48 U1.10
MOTY_SENSOR_FAR  (via drill 0.35)
  Top 0.254: v101.09,41.91 101.09,46.74 v102.11,47.75 | v33.02,37.59 v30.73,37.59
  Bottom 0.254: MOT2_SENSOR_SFAR1.1 109.22,49.4 107.22,49.4 105.57,47.75 v102.11,47.75 | v33.02,37.59 34.52,36.09 35.99,36.09 36.6,35.48 36.6,35.08 38.13,33.55 38.53,33.55 39.14,32.94 39.14,32.54 40.67,31.01 41.07,31.01 41.68,30.4 41.68,30 43.21,28.47 43.61,28.47 44.22,27.86 44.22,27.46 45.75,25.93 46.15,25.93 46.76,25.32 46.76,24.92 48.29,23.39 48.69,23.39 49.3,22.78 49.3,22.38 50.83,20.85 51.23,20.85 51.84,20.24 51.84,19.84 52.91,18.77 56.31,18.77 57.35,19.81 X5.6 X6.6 83.48,19.81 92.96,29.3 92.96,34.77 94.84,36.65 95.83,36.65 v101.09,41.91 | v30.73,37.59 30.61,37.72 EXIO1.5
MOTY_SENSOR_NEAR  (via drill 0.35)
  Top 0.254: EIO1_A7.2 53.59,40.39 v54.61,39.37
  Bottom 0.254: MOT2_SENSOR_SNEAR1.1 104.14,48.9 70.74,48.9 61.21,39.37 v54.61,39.37
MOTY_STEP
  Top 0.762: J1.9 U1.9
  Bottom 0.254: MOT2_MD_STEP1.1 94.4,63.75 84.6,73.56 82.4,73.56 79.76,76.2 J1.9
MOTZ_DIR  (via drill 0.35)
  Top 0.254: v97.54,26.67 93.09,31.11 93.09,58.84 92.86,59.07 92.86,59.96 92.61,60.21 92.61,61.91 92.31,62.21 92.31,62.76 92.61,63.06 92.61,64.11 v92.46,64.26
  Top 0.762: J1.8 U1.8
  Bottom 0.254: J1.8 72.39,73.15 83.57,73.15 v92.46,64.26 | MOT3_MD_DIR1.1 98.04,26.16 v97.54,26.67
MOTZ_SENSOR_FAR  (via drill 0.35)
  Top 0.254: v107.7,14.48 101.94,14.48 95.1,21.32 95.1,22.5 v90.17,27.43 | v34.04,38.61 v29.72,38.61
  Bottom 0.254: MOT3_SENSOR_SFAR1.1 107.95,14.22 v107.7,14.48 | v90.17,27.43 85.09,22.35 X6.7 X5.7 57.35,22.35 56.31,21.31 52.91,21.31 51.84,22.38 51.84,22.78 51.23,23.39 50.83,23.39 49.3,24.92 49.3,25.32 48.69,25.93 48.29,25.93 46.76,27.46 46.76,27.86 46.15,28.47 45.75,28.47 44.22,30 44.22,30.4 43.61,31.01 43.21,31.01 41.68,32.54 41.68,32.94 41.07,33.55 40.67,33.55 39.14,35.08 39.14,35.48 38.53,36.09 36.8,36.09 34.29,38.61 v34.04,38.61 | v29.72,38.61 29.59,38.73 29.59,45.69 EXIO1.6
MOTZ_SENSOR_NEAR  (via drill 0.35)
  Top 0.254: v107.7,17.78 104.9,20.57 101.17,20.57 91.9,29.84 91.9,39.32 v91.95,39.37 | EIO1_A8.2 58.85,39.95 59.17,39.95 60.77,38.35 v62.23,38.35
  Bottom 0.254: MOT3_SENSOR_SNEAR1.1 108.33,17.78 v107.7,17.78 | v62.23,38.35 80.93,38.35 81.57,38.99 87.06,38.99 87.44,39.37 v91.95,39.37
MOTZ_STEP  (via drill 0.35)
  Top 0.254: v97.54,27.94 93.5,31.98 93.5,59.01 93.27,59.24 93.27,62.18 v92.96,62.48
  Top 0.762: J1.7 U1.7
  Bottom 0.254: MOT3_MD_STEP1.1 v97.54,27.94 | v92.96,62.48 92.45,62.48 83.72,71.22 71.98,71.22 J1.7
N$8  (via drill 0.35)
  Top 0.254: X5.12 59.41,34.01 52.91,34.01 51.84,35.08 51.84,35.48 50.01,37.31 46,37.31 v31.5,51.82
  Bottom 0.254: X6.12 X5.12 | v31.5,51.82 30.61,52.7 EXIO1.12
N$12  (via drill 0.35)
  Top 0.254: v29.97,51.82 44.88,36.91 47.88,36.91 49.3,35.48 49.3,35.08 50.83,33.55 51.23,33.55 51.84,32.94 51.84,32.54 52.91,31.47 59.41,31.47 X5.11
  Bottom 0.254: X5.11 X6.11 | EXIO1.11 29.34,52.45 v29.97,51.82
N$14
  Bottom 0.254: X3.5 X4.5 16.13,19.43 16.13,19.63 17.81,21.31 18.21,21.31 18.82,21.92 18.82,35.48 16.13,38.18 EXIO2.4
N$15
  Bottom 0.254: X3.6 X4.6 16.59,22.43 16.59,35.87 14.73,37.73 14.73,44.96 14.99,45.21 14.86,45.34 EXIO2.5
N$16
  Bottom 0.254: X3.7 X4.7 13.97,22.66 16.18,24.87 16.18,35.7 13.59,38.29 EXIO2.6
N$17
  Bottom 0.254: X3.8 X4.8 13.97,25.2 15.77,27 15.77,35.53 12.45,38.86 12.45,45.82 EXIO2.7
N$18
  Bottom 0.254: X4.9 X3.9 7.87,27.74 5.26,30.35 5.26,46.44 11.05,52.24 EXIO2.9
N$19
  Top 0.762: J1.18 U1.18
N$21
  Bottom 0.254: X4.10 X3.10 7.87,30.28 5.66,32.49 5.66,46.28 12.32,52.93 EXIO2.10
N$22
  Bottom 0.254: INT_JUMP1.2 17.58,91.69 16.46,92.81 15.54,92.81 15.44,92.71 15.24,92.71 15.24,92.51 14.88,92.16 14.88,87.73 ETH0.J1.5
N$23
  Bottom 0.254: X4.11 X3.11 7.87,32.82 6.07,34.62 6.07,46.11 13.59,53.63 EXIO2.11
OENCX_A+
  Top 0.762: J1.3 U1.3
  Bottom 0.254: U1.3 66.51,63.01 66.51,91.13 68.11,92.72 72.53,92.72 77.37,97.56 81.6,97.56 82.27,96.89 82.27,95.94 81.13,94.8 OPTICAL_ENC_X:OENC.2
OENCX_B+
  Top 0.762: J1.4 U1.4
  Bottom 0.254: U1.4 68.57,64.02 66.92,65.67 66.92,81.38 68.09,82.55 75.49,82.55 OPTICAL_ENC_X:OENC.4
OENCY_A+
  Top 0.762: J1.5 U1.5
  Bottom 0.254: J1.5 73.71,66.04 OPTICAL_ENC_Y:OENC.2
OENCY_B+
  Top 0.762: J1.6 U1.6
  Bottom 0.254: OPTICAL_ENC_Y:OENC.4 81.13,54.41 80.09,55.45 80.09,56.95 72.16,64.87 71.4,64.87 70.71,65.56 70.71,66.52 71.88,67.69 J1.6
OPT0/ETH0_SEL  (via drill 0.35)
  Top 0.254: J2.6 U1.24 | X7.5 9.91,72.44 7.7,74.65 7.7,90.68 15.01,97.99 20.88,97.99 v23.88,95
  Bottom 0.254: J2.6 40.84,91.44 36.83,95.45 26.45,95.45 25.19,94.19 | INT_JUMP1.3 21.65,90.65 25.19,94.19 | v23.88,95 24.38,95 25.19,94.19
OPT1/U1_MISO
  Top 0.254: J2.7 | J2.7 U1.25 | ETH0.J2.6 41.14,88.89 J2.7
  Bottom 0.254: X7.6 9.91,74.98 8.1,76.78 8.1,91.09 15.01,97.99 37.32,97.99 41.25,94.06 41.25,93.5 42.14,92.61 42.9,92.61 43.59,91.92 43.59,91.22 U1.25
OPT2/EXIO2_INT
  Top 0.254: J2.8 U1.26
  Bottom 0.254: EXIO2.13 16.13,77.85 20.83,82.55 | J2.8 37.65,86.36 36.78,85.5 23.77,85.5 20.83,82.55 | X7.7 14.88,82.19 14.88,84.54 15.54,85.19 18.19,85.19 20.83,82.55
OPT3/U1_SCLK  (via drill 0.35)
  Top 0.254: J2.10 | J2.10 U1.28 | v28.96,82.3 22.1,89.15 ETH0.J1.4 14.2,90.96 8.71,90.96 8.1,90.35 8.1,81.86 9.91,80.06 X7.8 | v33.53,82.3 34.55,81.27 J2.10
  Bottom 0.254: v28.96,82.3 v33.53,82.3
OPT_MOTX_SENSOR_NEAR  (via drill 0.35)
  Top 0.254: v35.05,39.62 v28.7,39.62 | EIO1_A6.1 50.04,39.34 52.78,36.6 61.14,36.6 62.26,35.48 62.26,29.54 62.23,29.52 62.23,28.96 X6.8
  Bottom 0.254: X6.8 X5.8 57.35,24.89 56.31,23.85 52.91,23.85 51.84,24.92 51.84,25.32 51.23,25.93 50.83,25.93 49.3,27.46 49.3,27.86 48.69,28.47 48.29,28.47 46.76,30 46.76,30.4 46.15,31.01 45.75,31.01 44.22,32.54 44.22,32.94 43.61,33.55 43.21,33.55 41.68,35.08 41.68,35.48 41.07,36.09 39.6,36.09 36.07,39.62 v35.05,39.62 | v28.7,39.62 28.07,40.26 EXIO1.7
OPT_MOTY_SENSOR_NEAR  (via drill 0.35)
  Top 0.254: EIO1_A7.1 53.57,39.34 55.4,37.52 60.8,37.52 62.66,35.65 62.66,31.06 X6.9 | v26.92,51.82 42.65,36.09 43.61,36.09 44.22,35.48 44.22,35.08 45.75,33.55 46.15,33.55 46.76,32.94 46.76,32.54 48.29,31.01 48.69,31.01 49.3,30.4 49.3,30 50.83,28.47 51.23,28.47 51.84,27.86 51.84,27.46 52.91,26.39 59.41,26.39 X5.9
  Bottom 0.254: X5.9 X6.9 | EXIO1.9 26.8,51.94 v26.92,51.82
OPT_MOTZ_SENSOR_NEAR  (via drill 0.35)
  Top 0.254: X6.10 63.07,33.2 63.07,35.82 60.94,37.95 59.82,37.95 EIO1_A8.1 | v28.45,51.82 43.76,36.5 45.74,36.5 47.22,35.03 47.22,34.62 47.83,34.01 48.23,34.01 49.76,32.49 49.76,32.08 50.37,31.47 50.77,31.47 52.3,29.95 52.3,29.54 52.91,28.93 59.41,28.93 X5.10
  Bottom 0.254: X6.10 X5.10 | EXIO1.10 28.45,54.77 v28.45,51.82
U1_3V3  (via drill 1.02)
  Top 0.762: C2.2 J1.1 U1.1 56.21,55.87 54.61,54.27 41.87,54.27 30.48,65.66 30.48,88.14 v29.46,89.15
  Bottom 0.762: ETH0.J2.2 ETH0.J2.3 32,91.69 v29.46,89.15
U1_CLK
  Top 0.254: U1.20 J2.2
U1_EN
  Top 0.254: C2.1 J1.2 | U1.2 57.4,69.58 57.4,79.17 46.44,90.14 39.84,90.14 ETH0.J2.5
  Top 0.762: J1.2 U1.2
U1_IO21  (via drill 0.35)
  Top 0.254: U1.33 J2.15 v31.75,68.58 | EIO1_A6.3 v47.5,42.93 | X7.9 22.61,69.6 v22.61,68.58
  Bottom 0.254: v47.5,42.93 38.46,51.97 38.46,64.62 J2.15 | v31.75,68.58 v22.61,68.58
U1_IO22  (via drill 0.35)
  Top 0.254: U1.36 J2.18 39.13,60.96 v32.27,67.82 | EIO1_A7.3 52.83,42.67 v52.58,42.93 | v23.88,67.82 23.88,70.87 X7.10
  Bottom 0.254: v52.58,42.93 49.88,42.93 40.23,52.57 40.23,58.78 J2.18 | v32.27,67.82 v23.88,67.82
U1_IO23  (via drill 0.35)
  Top 0.254: U1.37 J2.19 40.28,60.55 38.96,60.55 32.46,67.06 v31.75,67.06 | EIO1_A8.3 56.67,41.43 v56.64,41.4 | v25.65,67.06 25.65,71.63 X7.11
  Bottom 0.254: v56.64,41.4 53.85,44.2 49.18,44.2 41.15,52.23 41.15,57.15 J2.19 | v31.75,67.06 v25.65,67.06
U1_MOSI  (via drill 0.35)
  Top 0.254: U1.23 J2.5 37.85,98.55 26.42,98.55 v26.42,94.49 | J_SK9822.3 71.63,32.93 73.53,34.83 73.53,39.24 v59.18,53.59
  Bottom 0.254: v59.18,53.59 59.18,80.71 U1.23 | v26.42,94.49 21.97,90.04 17.65,90.04 ETH0.J1.3
U1_RXD0
  Top 0.254: U1.34 J2.16
U1_SCL  (via drill 0.35)
  Top 0.254: J2.12 U1.30 | v32.89,60.96 v30.48,60.96
  Bottom 0.254: EXIO1.14 32.89,55.4 v32.89,60.96 32.89,63.39 41.99,72.49 42.9,72.49 43.59,73.18 43.59,75.03 J2.12 | EXIO2.14 17.4,55.67 22.69,60.96 v30.48,60.96
U1_SD0
  Top 0.254: U1.21 J2.3
U1_SD1
  Top 0.254: U1.22 J2.4
U1_SD2
  Top 0.762: J1.16 U1.16
U1_SD3
  Top 0.762: J1.17 U1.17
U1_SDA  (via drill 0.35)
  Top 0.254: J2.11 U1.29 | v30.48,59.18 v34.42,59.18
  Bottom 0.254: EXIO1.15 v34.42,59.18 34.42,62.23 42.04,69.85 42.94,69.85 43.99,70.9 43.99,77.17 J2.11 | EXIO2.15 18.67,55.81 22.04,59.18 v30.48,59.18
U1_TXD0
  Top 0.254: U1.35 J2.17

## Text on the board
tPlace: DRIVER2 | CON | DRIVER1 | OENC_X | MOT1_DEV_OPT2 | OPTIO | X | ETH0 | OENC_Y | DRIVER2 | CON | DRIVER1 | Xception TECH CO. | Y | OPT_SENS_NEAR_to_U1 | web.xception.tech | STXY V0.0.1 | EXIO2 | EXIO1 | DRIVER2 | CON | DRIVER1 | EMG STOP | POWER | 24V | 24VG | 5V | 5VG | DRV_DIV_SEL | Z | LED ARRAY>
bPlace: STXY V0.0.1 | 5V | IO15 | GND | IO17 | IO33 | GND | IO22 | web.xception.tech | Xception TECH CO. | EN | GND | 3V3